# EasyEDA Pro project EasyEDAPro-Schematic.epro, board MAIN
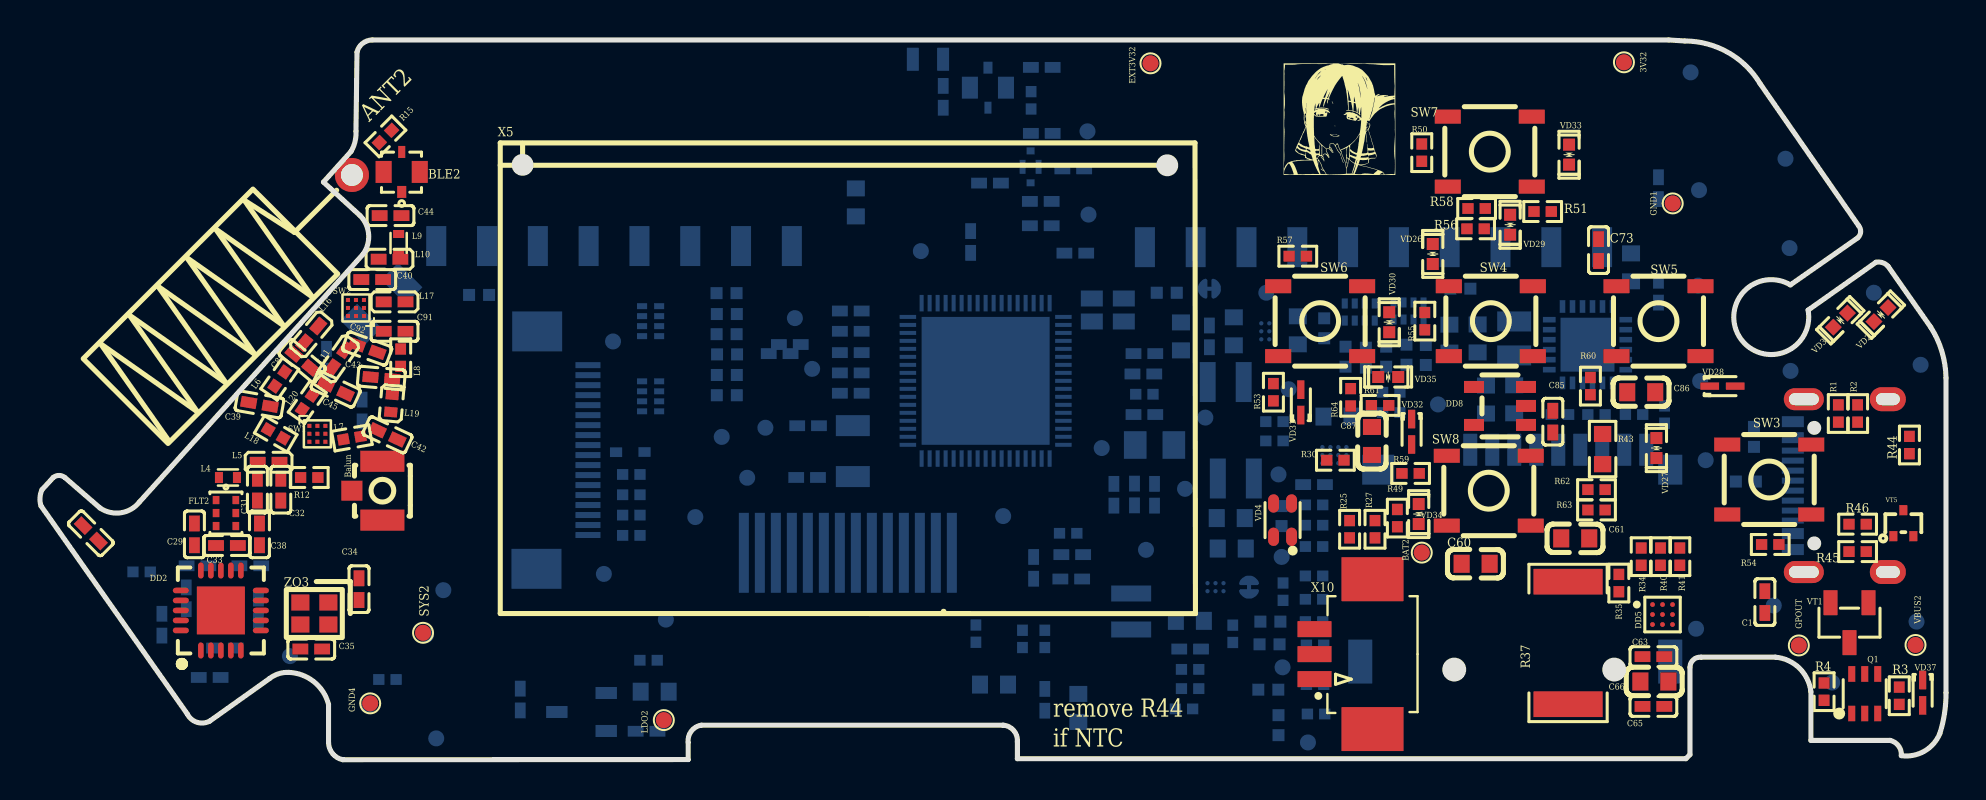
[diagram p10: board, top side]
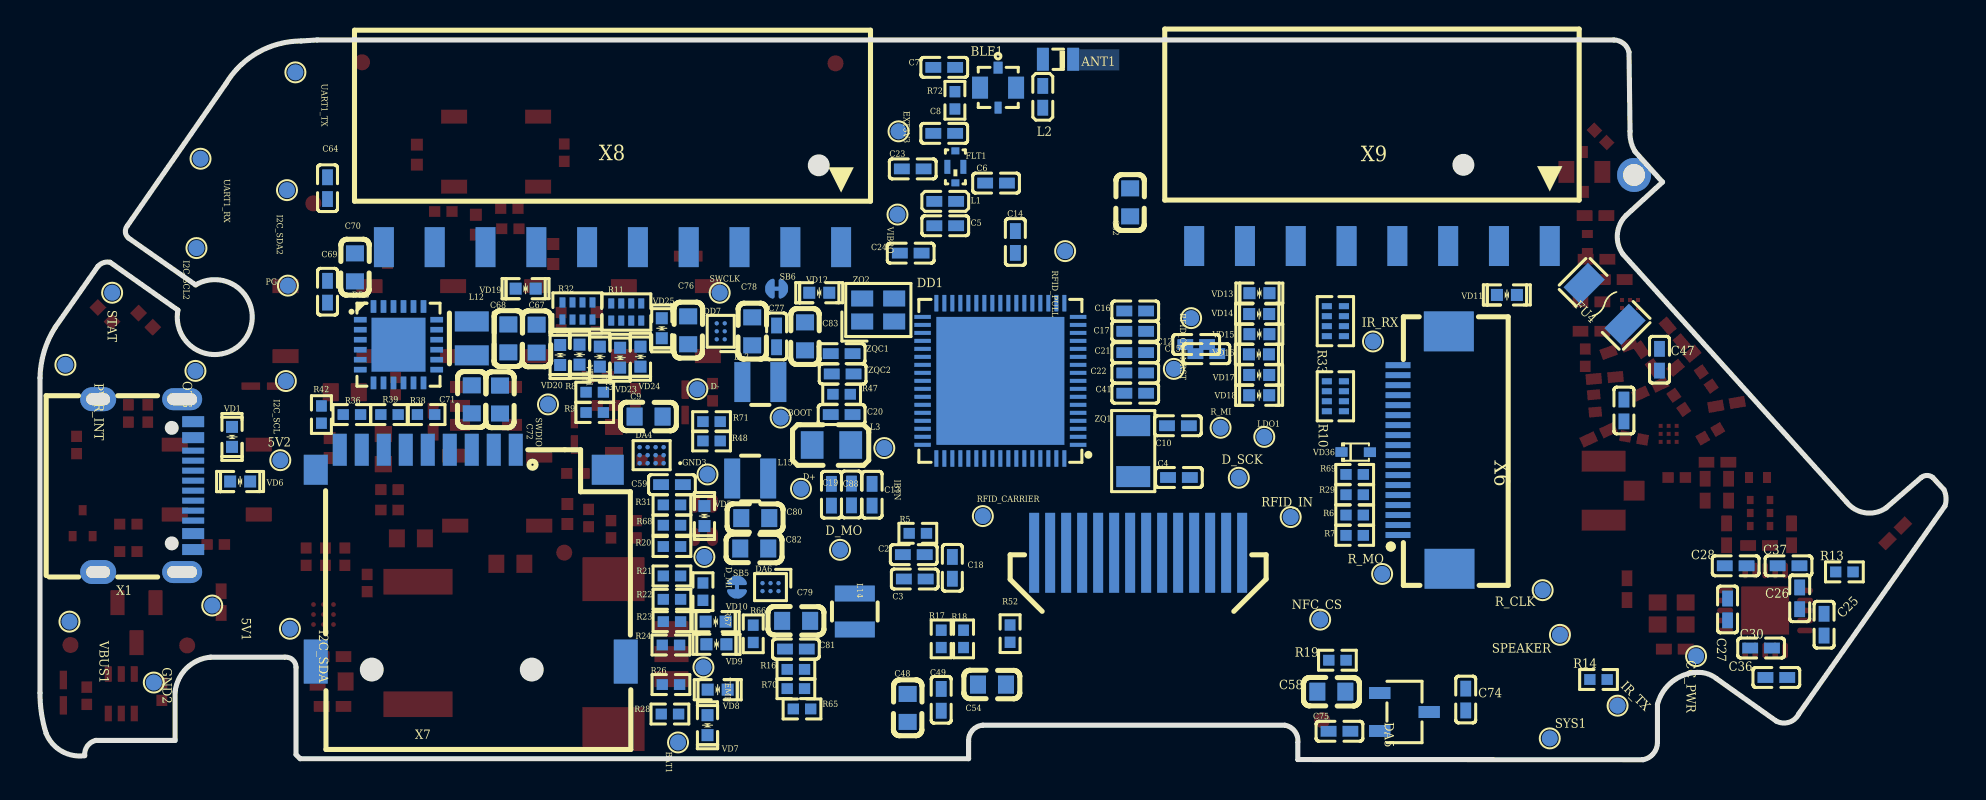
[diagram p11: board, bottom side, seen from below]

Outline 95.3 x 36.02 mm; copper layers: Top Layer, Bottom Layer. Coordinates in mm from the lower left corner of the outline.
Outline path: 0.05,12.7 arc(0,13.11) 0.1,13.51 0.66,14.12 arc(0.95,14.22) 1.24,14.12 3,12.6 arc(4.05,12.36) 4.98,12.9 16.15,25.3 arc(16.43,26.29) 16,27.23 14.17,28.91 15.54,30.43 arc(15.75,30.92) 15.8,31.45 15.85,35.41 arc(16.13,35.84) 16.61,36.02 81.43,36.02 82.25,35.97 arc(84.4,35.39) 86,33.83 90.93,26.72 arc(91.03,26.41) 90.88,26.11 87.52,23.76 arc(85.03,21.07) 88.4,22.5 91.8,24.89 arc(92.13,24.87) 92.41,24.69 94.54,21.64 arc(95.1,20.42) 95.3,19.1 95.3,3.35 arc(95.23,2.33) 95,1.32 arc(94.22,0.43) 93.07,0.2 arc(92.93,0.69) 92.51,0.97 88.55,0.97 88.55,3.4 arc(87.96,4.59) 86.77,5.13 83.06,5.13 arc(82.67,5) 82.5,4.62 82.5,0.25 82.3,0.05 48.87,0.05 48.87,0.91 arc(48.68,1.47) 48.16,1.73 33.07,1.73 arc(32.56,1.43) 32.41,0.86 32.41,0.01 15.14,0 arc(14.63,0.31) 14.43,0.86 14.43,2.77 arc(13.7,3.9) 12.45,4.37 arc(11.94,4.3) 11.48,4.06 8.48,1.93 arc(7.85,1.87) 7.37,2.29 0.05,12.7
Stack: Top Layer 0.035mm / Dielectric1 1.51mm FR4 er 4.5 / Bottom Layer 0.035mm

## Design rules (mm)
template: JLCPCB Capability(Two Layers Board)
spacing copperThickness1oz (default): track to track 0.102, other pairs 0.152 to 0.3
spacing copperThickness2oz: track to track 0.203, other pairs 0.152 to 0.3
track width copperThickness1oz (default): min 0.127, default 0.254, max 2.54
track width copperThickness2oz: min 0.203, default 0.254, max 2.54
differential pair differentialPair (default): width min 0.127, default 0.254, max 2.54; gap min 0.152, default 0.152
via viaSize (default): diameter min 0.5, default 0.61, max 10; hole min 0.3, default 0.305, max 6.3

## Placement (name value [footprint] x y rotation side)
3V32  -  [测试点0.8mm]  79.2 34.9 0 top
5V1  -  [测试点0.8mm]  86.69 7.72 180 bottom
5V2  -  [测试点0.8mm]  83.29 14.99 270 bottom
?  100pF  [C0402]  2.54 11.33 135 top
ANT1  KH-1608-H08  [ANT-SMD_L1.7-W0.9]  44.4 35.05 180 bottom
ANT2  VG868SNX18-5W2  [ANT-TH_VG868SNX18-5W2]  15.6 29.26 225 top
Balun  BWIPX-1-001E  [IPEX-SMD_BWIPX-1-001E]  16.36 13.46 0 top
BAT1  -  [测试点0.8mm]  63.4 0.86 180 bottom
BAT2  -  [测试点0.8mm]  69.09 10.36 0 top
BLE1  MM8030-2610RK0  [RF-SMD_MM8030-2610RK0]  47.4 33.63 0 bottom
BLE2  MM8030-2610RK0  [RF-SMD_MM8030-2610RK0]  18.08 29.41 0 top
BOOT  -  [测试点0.8mm]  58.27 17.12 270 bottom
C1  100nF  [C0402]  86.24 7.89 270 top
C2  100nF  [C0402]  51.61 10.26 180 bottom
C3  100nF  [C0402]  51.56 9.04 180 bottom
C4  12pF  [C0402]  38.35 14.12 0 bottom
C5  0.8pF  [C0402]  50.04 26.72 180 bottom
C6  0.3pF  [C0402]  47.5 28.85 180 bottom
C7  1.5pF  [C0402]  50.09 34.65 0 bottom
C8  1.5pF  [C0402]  50.09 31.34 0 bottom
C9  10uF  [C0603]  64.87 17.17 180 bottom
C10  12pF  [C0402]  38.4 16.71 0 bottom
C12  100nF  [C0402]  37.49 20.78 180 bottom
C13  100nF  [C0402]  53.7 13.26 270 bottom
C14  100nF  [C0402]  46.53 25.91 90 bottom
C15  4.7uF  [C0402]  36.98 20.32 180 bottom
C16  1uF  [C0402]  40.54 22.45 180 bottom
C17  10nF  [C0402]  40.54 21.44 180 bottom
C18  100nF  [C0402]  49.68 9.6 270 bottom
C19  4.7uF  [C0402]  55.73 13.26 270 bottom
C20  4.7uF  [C0402]  55.22 17.27 0 bottom
C21  1uF  [C0402]  40.54 20.37 180 bottom
C22  100nF  [C0402]  40.54 19.36 180 bottom
C23  100pF  [C0402]  51.66 29.57 180 bottom
C24  100nF  [C0402]  51.77 25.35 180 bottom
C25  100nF  [C0402]  6.1 6.76 90 bottom
C26  100nF  [C0402]  7.32 8.08 270 bottom
C27  100nF  [C0402]  10.92 7.52 270 bottom
C28  100nF  [C0402]  10.52 9.7 180 bottom
C29  100pF  [C0402]  7.72 11.28 270 top
C30  100nF  [C0402]  9.25 5.59 0 bottom
C31  1.5pF  [C0402]  10.87 13.51 270 top
C32  1.2pF  [C0402]  12.04 13.51 90 top
C33  0.6pF  [C0402]  9.35 10.72 180 top
C34  9pF  [C0402]  15.95 8.53 270 top
C35  9pF  [C0402]  13.56 5.54 180 top
C36  100nF  [C0402]  8.48 4.11 0 bottom
C37  100nF  [C0402]  7.87 9.7 0 bottom
C38  100pF  [C0402]  10.97 11.28 270 top
C39  1.5pF  [C0402]  10.97 17.78 350 top
C40  1.5pF  [C0402]  16.61 24.03 0 top
C41  100nF  [C0402]  40.54 18.34 0 bottom
C42  10pF  [C0402]  17.37 16.26 155 top
C43  10pF  [C0402]  17.07 19.1 355 top
C44  1.5pF  [C0402]  17.53 27.23 180 top
C45  8.2pF  [C0402]  14.78 18.54 155 top
C46  10nF  [C0402]  16.1 17.48 270 bottom
C47  10nF  [C0402]  14.33 20.02 270 bottom
C48  10uF  [C0603]  51.92 2.59 270 bottom
C49  100nF  [C0402]  50.24 3 270 bottom
C54  2.2uF  [C0603]  47.7 3.76 180 bottom
C58  2.2uF  [C0603]  30.73 3.4 0 bottom
C59  1uF  [C0402]  63.7 13.77 180 bottom
C60  10uF  [C0603]  71.78 9.8 0 top
C61  10uF  [C0603]  76.76 11.07 0 top
C62  10uF  [C0603]  40.79 27.89 90 bottom
C63  1uF  [C0402]  80.67 5.16 180 top
C64  47nF  [C0402]  80.92 28.6 270 bottom
C65  470nF  [C0402]  80.67 2.67 0 top
C66  2.2uF  [C0603]  80.72 3.91 0 top
C67  10uF  [C0603]  70.47 21.07 90 bottom
C68  10uF  [C0603]  71.88 21.08 90 bottom
C69  1uF  [C0402]  80.92 23.42 90 bottom
C70  10uF  [C0603]  79.55 24.64 270 bottom
C71  10uF  [C0603]  73.71 18.03 90 bottom
C72  10uF  [C0603]  72.3 18.02 90 bottom
C73  4.7uF  [C0402]  77.93 25.5 270 top
C74  1uF  [C0402]  24.01 3.01 270 bottom
C75  1uF  [C0402]  30.33 1.42 180 bottom
C76  2.2uF  [C0603]  62.89 21.49 270 bottom
C77  4.7uF  [C0402]  58.47 21.18 90 bottom
C78  2.2uF  [C0603]  59.69 21.44 270 bottom
C79  2.2uF  [C0603]  57.49 6.95 180 bottom
C80  10uF  [C0603]  59.54 12.09 180 bottom
C81  4.7uF  [C0402]  57.51 5.54 180 bottom
C82  2.2uF  [C0603]  59.59 10.57 180 bottom
C83  10uF  [C0603]  57.05 21.18 90 bottom
C85  100nF  [C0402]  75.64 16.92 90 top
C86  10uF  [C0603]  80.06 18.39 0 top
C87  10uF  [C0603]  66.6 15.95 90 top
C88  100nF  [C0402]  54.73 13.27 270 bottom
C89  1.5pF  [C0402]  13.11 19.96 140 top
C91  22pF  [C0402]  17.73 21.44 0 top
C92  1.5pF  [C0402]  16.36 20.57 340 top
CC_PWR  -  [测试点0.8mm]  12.5 5.18 180 bottom
D+  -  [测试点0.8mm]  57.25 13.56 180 bottom
D-  -  [测试点0.8mm]  62.43 18.54 180 bottom
D_MI  -  [测试点0.8mm]  62.08 10.15 180 bottom
D_MO  -  [测试点0.8mm]  55.3 10.5 180 bottom
D_SCK  -  [测试点0.8mm]  35.36 14.11 180 bottom
DA4  LP5562TMX/NOPB  [DSBGA-12_L1.7-W1.3-R3-C4-P0.40-TL]  64.72 15.24 0 bottom
DA5  RS3221-3.3YF3  [SOT-23-3_L2.9-W1.6-P1.90-LS2.8-BR]  27.08 2.39 0 bottom
DA6  LM3281YFQR  [DSBGA-6_L1.4-W1.1-R3-C2-P0.40-BL]  58.78 8.64 0 bottom
DD1  -  [QFN-68_L8.0-W8.0-P0.40-TL-EP6.4]  47.28 18.96 0 bottom
DD2  300 ~ 348 MHz, 387 ~ 464 MHz, 779 ~ 928 MHz  [QFN-20_L4.0-W4.0-P0.5-TL-EP]  9.04 7.47 90 top
DD5  BQ27220YZFR  [DSBGA-9_L1.7-W1.6-R3-C3-P0.50-BL]  81.13 7.26 270 top
DD6  BQ25896RTWR  [QFN-24_L4.0-W4.0-P0.50-TL-EP2.7]  77.38 20.77 180 bottom
DD7  LM3281YFQR  [DSBGA-6_L1.4-W1.1-R3-C2-P0.40-BL]  61.26 21.44 90 bottom
DD8  SN74LVC1G32DBVR  [SOT-23-5_L3.0-W1.7-P0.95-LS2.8-BR]  73 17.7 0 top
EXT3V3  -  [测试点0.8mm]  52.37 31.45 180 bottom
EXT3V32  -  [测试点0.8mm]  55.52 34.85 0 top
FLT1  LFB182G45SG9A272  [FILTER-SMD_0603-4P-L1.6-W0.8-T]  49.53 29.67 90 bottom
FLT2  B0310J50100AHF  [XFMR-SMD_6P-L2.1-W1.3-P0.65-BL]  9.3 12.34 270 top
FU4  0466004.NRHF  [F1206]  17.07 22.81 225 bottom
GND1  -  [测试点0.8mm]  81.64 27.84 0 top
GND2  -  [测试点0.8mm]  89.61 3.86 180 bottom
GND3  -  [测试点0.8mm]  61.93 14.27 180 bottom
GND4  -  [测试点0.8mm]  16.51 2.82 0 top
GPOUT  -  [测试点0.8mm]  87.94 5.72 0 top
I2C_SCL  -  [测试点0.8mm]  83.01 18.95 180 bottom
I2C_SCL2  -  [测试点0.8mm]  87.48 25.6 90 bottom
I2C_SDA  -  [测试点0.8mm]  82.8 6.55 180 bottom
I2C_SDA2  -  [测试点0.8mm]  82.95 28.5 90 bottom
IBTN  -  [测试点0.8mm]  53.09 15.6 180 bottom
IR_RX  -  [测试点0.8mm]  28.65 20.93 180 bottom
IR_TX  -  [测试点0.8mm]  16.42 2.7 180 bottom
L1  2.7nH  [L0402]  50.04 27.94 180 bottom
L2  0.3nH  [L0402]  45.16 33.17 90 bottom
L3  10uH  [L0805]  55.73 15.75 180 bottom
L4  3.3nH  [IND-SMD_L1.0-W0.5-2]  9.4 14.12 0 top
L5  6.8nH  [L0402]  11.43 14.88 0 top
L6  0Ω  [R0402]  11.99 19.05 55 top
L7  0Ω  [R0402]  15.6 16.1 10 top
L8  0Ω  [R0402]  18.03 20.12 90 top
L9  2.2nH  [IND-SMD_L1.0-W0.5-2]  17.93 25.86 90 top
L10  DNF  [L0402]  17.48 25.04 0 top
L11  2.7nH  [L0402]  14.94 20.07 55 top
L12  1uH  [IND-SMD_L2.0-W1.6-B]  73.71 21.08 270 bottom
L13  470nH  [IND-SMD_L2.0-W1.6_MHCHL201610A-1R0M-Q8A]  59.28 18.9 180 bottom
L14  470nH  [IND-SMD_L2.0-W1.6_MHCHL201610A-1R0M-Q8A]  54.56 7.42 270 bottom
L15  470nH  [IND-SMD_L2.0-W1.6_MHCHL201610A-1R0M-Q8A]  59.79 14.07 0 bottom
L16  56nH  [L0402]  13.56 21.29 50 top
L17  22nH  [L0402]  17.73 22.91 180 top
L18  0Ω  [R0402]  11.79 16.31 150 top
L19  27nH  [IND-SMD_L1.0-W0.6]  17.58 17.83 85 top
L20  0Ω  [R0402]  13.36 17.88 55 top
LDO1  -  [测试点0.8mm]  34.09 16.15 180 bottom
LDO2  -  [测试点0.8mm]  31.19 1.98 0 top
NFC_CS  -  [测试点0.8mm]  31.29 7.01 180 bottom
NRST  -  [测试点0.8mm]  38.61 19.56 180 bottom
OTG  -  [测试点0.8mm]  87.53 19.46 180 bottom
PG  -  [测试点0.8mm]  82.91 23.72 180 bottom
PWR_INT  -  [测试点0.8mm]  94.03 19.76 180 bottom
Q1  MMDT2907A-7-F  [SOT-363_L2.0-W1.3-P0.65-LS2.1-BL]  91.24 3.3 0 top
R1  5.1kΩ  [R0402]  89.92 17.32 270 top
R2  5.1kΩ  [R0402]  90.88 17.32 270 top
R3  100kΩ  [R0402]  92.96 3.2 270 top
R4  100kΩ  [R0402]  89.2 3.4 90 top
R5  10kΩ  [R0402]  51.41 11.33 0 bottom
R6  51Ω  [R0402]  29.57 12.24 180 bottom
R7  51Ω  [R0402]  29.57 11.23 0 bottom
R8  22Ω  [R0402]  67.56 18.39 180 bottom
R9  22Ω  [R0402]  67.56 17.37 180 bottom
R10  51Ω  [RES-ARRAY-SMD_0402-8P-L2.0-W1.0-BL]  30.53 18.19 270 bottom
R11  51Ω  [RES-ARRAY-SMD_0402-8P-L2.0-W1.0-BL]  65.99 22.4 180 bottom
R12  0Ω  [R0402]  13.46 14.12 0 top
R13  56kΩ  [R0402]  5.08 9.4 180 bottom
R14  330Ω  [R0402]  17.37 4.01 0 bottom
R15  0Ω  [R0402]  17.27 31.19 225 top
R16  1.5Ω  [R0402]  57.51 4.52 0 bottom
R17  10kΩ  [R0402]  50.24 6.05 90 bottom
R18  10kΩ  [R0402]  49.12 6.05 90 bottom
R19  0Ω  [R0402]  30.43 4.98 180 bottom
R20  0Ω  [R0402]  63.7 10.67 0 bottom
R21  47kΩ  [R0402]  63.7 9.19 0 bottom
R22  47kΩ  [R0402]  63.7 8.03 0 bottom
R23  150Ω  [R0402]  63.7 6.91 180 bottom
R24  51Ω  [R0402]  63.75 5.74 180 bottom
R25  0Ω  [R0402]  65.48 11.53 90 top
R26  51Ω  [R0402]  63.75 3.76 180 bottom
R27  0Ω  [R0402]  66.75 11.53 90 top
R28  51Ω  [R0402]  63.8 2.29 180 bottom
R29  51Ω  [R0402]  29.57 13.26 0 bottom
R30  0Ω  [R0402]  64.77 14.99 0 top
R31  150Ω  [R0402]  63.7 12.75 180 bottom
R32  51Ω  [RES-ARRAY-SMD_0402-8P-L2.0-W1.0-BL]  68.43 22.45 180 bottom
R33  51Ω  [RES-ARRAY-SMD_0402-8P-L2.0-W1.0-BL]  30.53 21.95 270 bottom
R34  10kΩ  [R0402]  80.06 10.16 270 top
R35  10kΩ  [R0402]  78.94 8.84 90 top
R36  470Ω  [R0402]  79.71 17.27 180 bottom
R37  10mΩ  [R2512]  76.4 5.84 270 top
R38  5.23kΩ  [R0402]  76 17.27 0 bottom
R39  30.1kΩ  [R0402]  77.83 17.27 180 bottom
R40  1.5kΩ  [R0402]  81.03 10.16 90 top
R41  1.5kΩ  [R0402]  81.99 10.16 90 top
R42  1.5kΩ  [R0402]  81.23 17.27 270 bottom
R43  NCP18XH103F03RB  [R0603]  78.13 15.55 270 top
R44  10kΩ  [R0402]  93.47 15.75 90 top
R45  100Ω  [R0402]  90.88 10.41 0 top
R46  10kΩ  [R0402]  90.88 11.79 0 top
R47  10kΩ  [R0402]  55.22 18.29 0 bottom
R48  3.3Ω  [R0402]  61.72 15.95 0 bottom
R49  10kΩ  [R0402]  67.87 12.09 90 top
R50  10kΩ  [R0402]  69.09 30.38 270 top
R51  10kΩ  [R0402]  75.13 27.43 0 top
R52  10kΩ  [R0402]  46.8 6.31 270 bottom
R53  10kΩ  [R0402]  61.67 18.39 90 top
R54  330Ω  [R0402]  86.51 10.77 0 top
R55  330Ω  [R0402]  69.24 21.95 90 top
R56  330Ω  [R0402]  71.78 26.57 0 top
R57  330Ω  [R0402]  62.89 25.2 0 top
R58  330Ω  [R0402]  71.83 27.58 0 top
R59  330Ω  [R0402]  68.53 14.33 0 top
R60  100kΩ  [R0402]  77.52 18.69 270 top
R61  10kΩ  [R0402]  67.01 17.73 0 top
R62  10kΩ  [R0402]  77.83 13.51 0 top
R63  510Ω  [R0402]  77.83 12.5 0 top
R64  100kΩ  [R0402]  65.53 18.14 270 top
R65  10kΩ  [R0402]  57.2 2.54 0 bottom
R66  10kΩ  [R0402]  59.64 6.3 270 bottom
R67  10kΩ  [R0402]  62.15 8.41 90 bottom
R68  47kΩ  [R0402]  63.7 11.73 180 bottom
R69  1kΩ  [R0402]  29.57 14.27 180 bottom
R70  1.5Ω  [R0402]  57.51 3.56 0 bottom
R71  3.3Ω  [R0402]  61.72 16.92 0 bottom
R72  0Ω  [R0402]  49.55 33 90 bottom
R_CLK  -  [测试点0.8mm]  20.17 8.48 180 bottom
R_MI  -  [测试点0.8mm]  36.27 16.61 180 bottom
R_MO  -  [测试点0.8mm]  28.19 9.3 180 bottom
RFID_CARRIER  -  [测试点0.8mm]  48.16 12.19 180 bottom
RFID_IN  -  [测试点0.8mm]  32.77 12.14 180 bottom
RFID_OUT  -  [测试点0.8mm]  37.74 22.1 180 bottom
RFID_PULL  -  [测试点0.8mm]  44.04 25.45 180 bottom
SB5  net tie  [Solderbridge_Shorted]  60.45 8.64 90 bottom
SB6  net tie  [Solderbridge_Shorted]  58.47 23.57 180 bottom
SPEAKER  -  [测试点0.8mm]  19.3 6.25 180 bottom
STAT  -  [测试点0.8mm]  91.69 23.37 180 bottom
SW1  BGS 13S4N9 E6327  [TSNP-9_L1.1-W1.1-P0.40-BL]  13.87 16.31 270 top
SW2  BGS 13S4N9 E6327  [TSNP-9_L1.1-W1.1-P0.40-BL]  15.8 22.61 90 top
SW3  TS45055A  [SW-SMD_4P-L4.5-W4.5-P3.50-LS5.0]  86.46 14.02 0 top
SW4  TS45055A  [SW-SMD_4P-L4.5-W4.5-P3.50-LS5.0]  72.54 21.95 180 top
SW5  TS45055A  [SW-SMD_4P-L4.5-W4.5-P3.50-LS5.0]  80.92 21.95 0 top
SW6  TS45055A  [SW-SMD_4P-L4.5-W4.5-P3.50-LS5.0]  64.01 21.95 0 top
SW7  TS45055A  [SW-SMD_4P-L4.5-W4.5-P3.50-LS5.0]  72.49 30.43 0 top
SW8  TS45055A  [SW-SMD_4P-L4.5-W4.5-P3.50-LS5.0]  72.44 13.46 0 top
SWCLK  -  [测试点0.8mm]  61.32 23.37 180 bottom
SWDIO  -  [测试点0.8mm]  69.9 17.78 180 bottom
SYS1  -  [测试点0.8mm]  19.81 1.07 180 bottom
SYS2  -  [测试点0.8mm]  19.15 6.35 0 top
TEMP  -  [测试点0.8mm]  62.13 4.62 180 bottom
UART1_RX  -  [测试点0.8mm]  87.27 30.07 180 bottom
UART1_TX  -  [测试点0.8mm]  82.53 34.4 180 bottom
VBUS1  -  [测试点0.8mm]  93.83 6.91 180 bottom
VBUS2  -  [测试点0.8mm]  93.78 5.74 0 top
VD1  AU0561M1S  [D0402-BI]  85.7 16.15 90 bottom
VD2  AU0561M1S  [D0402-BI]  92.05 22.28 45 top
VD3  AU0561M1S  [D0402-BI]  90.02 22 45 top
VD4  LTST-C19HE1WT  [LED-ARRAY-SMD_4P-L1.6-W1.6-TL-CW]  62.13 11.99 180 top
VD5  AU0561M1S  [D0402-BI]  62.08 12.19 270 bottom
VD6  AU0561M1S  [D0402-BI]  85.29 13.92 180 bottom
VD7  AU0561M1S  [D0402-BI]  61.93 1.73 90 bottom
VD8  AU0561M1S  [D0402-BI]  61.42 3.51 0 bottom
VD9  AU0561M1S  [D0402-BI]  61.48 5.78 0 bottom
VD10  AU0561M1S  [D0402-BI]  61.52 6.91 0 bottom
VD11  AU0561M1S  [D0402-BI]  21.95 23.26 180 bottom
VD12  AU0561M1S  [D0402-BI]  56.34 23.37 180 bottom
VD13  AU0561M1S  [D0402-BI]  34.33 23.35 180 bottom
VD14  AU0561M1S  [D0402-BI]  34.34 22.3 180 bottom
VD15  AU0561M1S  [D0402-BI]  34.33 21.29 180 bottom
VD16  AU0561M1S  [D0402-BI]  34.35 20.28 180 bottom
VD17  AU0561M1S  [D0402-BI]  34.34 19.25 180 bottom
VD18  AU0561M1S  [D0402-BI]  34.34 18.24 180 bottom
VD19  AU0561M1S  [D0402-BI]  71.02 23.57 180 bottom
VD20  AU0561M1S  [D0402-BI]  69.29 20.25 90 bottom
VD21  AU0561M1S  [D0402-BI]  68.33 20.27 90 bottom
VD22  AU0561M1S  [D0402-BI]  67.31 20.17 90 bottom
VD23  AU0561M1S  [D0402-BI]  66.29 20.12 90 bottom
VD24  AU0561M1S  [D0402-BI]  65.28 20.17 90 bottom
VD25  AU0561M1S  [D0402-BI]  64.21 21.59 90 bottom
VD26  AU0561M1S  [D0402-BI]  69.64 25.31 270 top
VD27  AU0561M1S  [D0402-BI]  80.82 15.6 90 top
VD28  1N4148WT  [SOD-523_L1.2-W0.8-LS1.6-RD]  84.12 18.69 0 top
VD29  AU0561M1S  [D0402-BI]  73.51 26.77 90 top
VD30  AU0561M1S  [D0402-BI]  67.46 21.89 90 top
VD31  1N4148WT  [SOD-523_L1.2-W0.8-LS1.6-RD]  63.04 17.88 90 top
VD32  1N4148WT  [SOD-523_L1.2-W0.8-LS1.6-RD]  68.58 16.41 270 top
VD33  AU0561M1S  [D0402-BI]  76.45 30.28 90 top
VD34  AU0561M1S  [D0402-BI]  68.94 12.29 90 top
VD35  AU0561M1S  [D0402-BI]  67.41 19.15 0 top
VD36  1N4148X-TP  [SOD-523F_L1.2-W0.8-LS1.7-RD]  29.51 15.39 180 bottom
VD37  DNF  [SOD-523_L1.2-W0.8-LS1.6-RD]  94.13 3.35 270 top
VIBRO  -  [测试点0.8mm]  52.43 27.28 180 bottom
VT1  DMP1045U-7  [SOT-23-3_L2.9-W1.3-P1.90-LS2.4-BR]  90.47 6.86 90 top
VT5  DMN313DLT-7  [SOT-523-3_L1.6-W0.8-P1.00-LS1.6-BR]  93.17 11.84 270 top
X1  TYPE-C 16PIN 2MD(073)  [USB-C-SMD_TYPE-C-6PIN-2MD-073]  90.02 13.72 270 bottom
X5  -  [COG12864-12]  40.39 7.57 0 top
X6  FPC-05F-18PH20  [FPC-SMD_18P-P0.50_FPC-05F-18PH20]  26.11 15.49 90 bottom
X7  TF PUSH  [TF-SMD_TF-PUSH]  73.76 10.21 180 bottom
X8  -  [HDR-SMD_10P-P2.54-H-F-L11.5]  66.04 25.76 0 bottom
X9  X6511FRS-08-C85D30  [HDR-SMD_8P-P2.54-H-F-L11.5]  28.7 25.7 0 bottom
X10  1.25T-3P卧贴  [CONN-SMD_3P-P1.25_1.25T-3PWT]  65.18 5.28 270 top
ZQ1  32.768kHz  [OSC-SMD_L3.2-W1.5]  40.64 15.44 270 bottom
ZQ2  32MHz  [CRYSTAL-SMD_4P-L2.0-W1.6-BL-2]  53.39 22.5 180 bottom
ZQ3  26MHz  [CRYSTAL-SMD_4P-L2.0-W1.6-BL_HUAXIN_CN4]  13.72 7.32 180 top
ZQC1  18pF  [C0402]  55.22 20.32 180 bottom
ZQC2  18pF  [C0402]  55.17 19.3 180 bottom

## Footprints (pads in the part's own frame, mm; a bottom-side part is the same pattern mirrored in y, then rotated)
ANT-SMD_L1.7-W0.9
  rect 0.6x1.15 smd: 1(-0.756,0) 2(0.756,0)
ANT-TH_VG868SNX18-5W2
  round 1.7 hole 1.1: 1(0,0)
C0402
  rect 0.79x0.54 smd: 1(-0.545,0) 2(0.545,0)
C0603
  rect 0.8x0.9 smd: 1(-0.7,0) 2(0.7,0)
COG12864-12
  rect 0.5x4 smd far side: 1(5.207,2.785) 2(4.407,2.785) 3(3.607,2.785) 4(2.807,2.785) 5(2.007,2.785) 6(1.207,2.785) 7(0.407,2.785) 8(-0.393,2.785) 9(-1.193,2.785) 10(-1.993,2.785) 11(-2.793,2.785) 12(-3.593,2.785) 13(-4.393,2.785) 14(-5.193,2.785)
CONN-SMD_3P-P1.25_1.25T-3PWT
  rect 0.8x1.7 smd: 1(1.25,-1.45) 2(0,-1.45) 3(-1.25,-1.45)
  rect 2.2x3.1 smd: 4(-3.75,1.45) 5(3.75,1.45)
CRYSTAL-SMD_4P-L2.0-W1.6-BL-2
  rect 1.1x0.8 smd: 1(-0.8,-0.575) 2(0.8,-0.575) 3(0.8,0.575) 4(-0.8,0.575)
CRYSTAL-SMD_4P-L2.0-W1.6-BL_HUAXIN_CN4
  rect 0.9x0.8 smd: 1(-0.7,-0.55) 2(0.7,-0.55) 3(0.7,0.55) 4(-0.7,0.55)
D0402-BI
  rect 0.6x0.6 smd: 1(-0.5,0) 2(0.5,0)
DSBGA-6_L1.4-W1.1-R3-C2-P0.40-BL
  round 0.216 smd: A1(-0.4,-0.2) A2(-0.4,0.2) B1(0,-0.2) B2(0,0.2) C1(0.4,-0.2) C2(0.4,0.2)
DSBGA-9_L1.7-W1.6-R3-C3-P0.50-BL
  round 0.24 smd: A1(-0.5,-0.5) A2(-0.5,0) A3(-0.5,0.5) B1(0,-0.5) B2(0,0) B3(0,0.5) C1(0.5,-0.5) C2(0.5,0) C3(0.5,0.5)
DSBGA-12_L1.7-W1.3-R3-C4-P0.40-TL
  round 0.225 smd: A1(-0.6,0.4) A2(-0.2,0.4) A3(0.2,0.4) A4(0.6,0.4) B1(-0.6,0) B2(-0.2,0) B3(0.2,0) B4(0.6,0) C1(-0.6,-0.4) C2(-0.2,-0.4) C3(0.2,-0.4) C4(0.6,-0.4)
F1206
  rect 1.19x1.728 smd: 1(-1.445,0) 2(1.445,0)
FILTER-SMD_0603-4P-L1.6-W0.8-T
  rect 0.7x0.3 smd: 1(0,0.4) 3(0,-0.4)
  rect 0.35x0.4 smd: 2(0.8,0) 4(-0.8,0)
FPC-SMD_18P-P0.50_FPC-05F-18PH20
  rect 0.3x1.25 smd: 1(-4.25,1.288) 2(-3.75,1.288) 3(-3.25,1.288) 4(-2.75,1.288) 5(-2.25,1.288) 6(-1.75,1.288) 7(-1.25,1.288) 8(-0.75,1.288) 9(-0.25,1.288) 10(0.25,1.288) 11(0.75,1.288) 12(1.25,1.288) 13(1.75,1.288) 14(2.25,1.288) 15(2.75,1.288) 16(3.25,1.288) 17(3.75,1.288) 18(4.25,1.288)
  rect 2x2.5 smd: 19(-5.94,-1.288) 20(5.94,-1.252)
HDR-SMD_8P-P2.54-H-F-L11.5
  rect 1x2 smd: 1(-8.89,0) 2(-6.35,0) 3(-3.81,0) 4(-1.27,0) 5(1.27,0) 6(3.81,0) 7(6.35,0) 8(8.89,0)
HDR-SMD_10P-P2.54-H-F-L11.5
  rect 1x2 smd: 1(-10.795,0.107) 2(-8.255,0.107) 3(-5.715,0.107) 4(-3.175,0.107) 5(-0.635,0.107) 6(1.905,0.107) 7(4.445,0.107) 8(6.985,0.107) 9(9.525,0.107) 10(12.065,0.107)
IND-SMD_L1.0-W0.5-2
  rect 0.4x0.55 smd: 1(-0.45,0) 2(0.45,0)
IND-SMD_L1.0-W0.6
  rect 0.5x0.648 smd: 1(-0.434,0) 2(0.434,0)
IND-SMD_L2.0-W1.6-B
  rect 1x1.7 smd: 1(-0.85,0) 2(0.85,0)
IND-SMD_L2.0-W1.6_MHCHL201610A-1R0M-Q8A
  rect 0.8x2 smd: 1(-0.9,0) 2(0.9,0)
IPEX-SMD_BWIPX-1-001E
  rect 1.05x1 smd: 1(-0.762,0)
  rect 2.2x1.05 smd: 2(0.762,-1.475) 3(0.762,1.475)
L0402
  rect 0.79x0.54 smd: 1(-0.545,0) 2(0.545,0)
L0805
  rect 1.133x1.377 smd: 1(-0.966,0) 2(0.966,0)
LED-ARRAY-SMD_4P-L1.6-W1.6-TL-CW
  oval 0.55x0.917 smd: 1(-0.45,0.834) 2(0.45,0.834) 3(0.45,-0.834) 4(-0.45,-0.834)
OSC-SMD_L3.2-W1.5
  rect 1.05x1.7 smd: 1(-1.275,0) 2(1.275,0)
QFN-20_L4.0-W4.0-P0.5-TL-EP
  oval 0.8x0.28 smd: 1(-2,1) 2(-2,0.5) 3(-2,0) 4(-2,-0.5) 5(-2,-1) 11(2,-1) 12(2,-0.5) 13(2,0) 14(2,0.5) 15(2,1)
  oval 0.28x0.8 smd: 6(-1,-2) 7(-0.5,-2) 8(0,-2) 9(0.5,-2) 10(1,-2) 16(1,2) 17(0.5,2) 18(0,2) 19(-0.5,2) 20(-1,2)
  rect 2.4x2.4 smd: 21(0,0)
QFN-24_L4.0-W4.0-P0.50-TL-EP2.7
  rect 0.633x0.28 smd: 1(-1.911,1.25) 2(-1.911,0.75) 3(-1.911,0.25) 4(-1.911,-0.25) 5(-1.911,-0.75) 6(-1.911,-1.25) 13(1.911,-1.25) 14(1.911,-0.75) 15(1.911,-0.25) 16(1.911,0.25) 17(1.911,0.75) 18(1.911,1.25)
  rect 0.28x0.633 smd: 7(-1.25,-1.911) 8(-0.75,-1.911) 9(-0.25,-1.911) 10(0.25,-1.911) 11(0.75,-1.911) 12(1.25,-1.911) 19(1.25,1.911) 20(0.75,1.911) 21(0.25,1.911) 22(-0.25,1.911) 23(-0.75,1.911) 24(-1.25,1.911)
  rect 2.7x2.7 smd: 25(0,0)
QFN-68_L8.0-W8.0-P0.40-TL-EP6.4
  rect 0.825x0.2 smd: 1(-3.888,3.2) 2(-3.888,2.8) 3(-3.888,2.4) 4(-3.888,2) 5(-3.888,1.6) 6(-3.888,1.2) 7(-3.888,0.8) 8(-3.888,0.4) 9(-3.888,0) 10(-3.888,-0.4) 11(-3.888,-0.8) 12(-3.888,-1.2) 13(-3.888,-1.6) 14(-3.888,-2) 15(-3.888,-2.4) 16(-3.888,-2.8) 17(-3.888,-3.2) 35(3.888,-3.2) 36(3.888,-2.8) 37(3.888,-2.4) 38(3.888,-2) 39(3.888,-1.6) 40(3.888,-1.2) 41(3.888,-0.8) 42(3.888,-0.4) 43(3.888,0) 44(3.888,0.4) 45(3.888,0.8) 46(3.888,1.2) 47(3.888,1.6) 48(3.888,2) 49(3.888,2.4) 50(3.888,2.8) 51(3.888,3.2)
  rect 0.2x0.825 smd: 18(-3.2,-3.888) 19(-2.8,-3.888) 20(-2.4,-3.888) 21(-2,-3.888) 22(-1.6,-3.888) 23(-1.2,-3.888) 24(-0.8,-3.888) 25(-0.4,-3.888) 26(0,-3.888) 27(0.4,-3.888) 28(0.8,-3.888) 29(1.2,-3.888) 30(1.6,-3.888) 31(2,-3.888) 32(2.4,-3.888) 33(2.8,-3.888) 34(3.2,-3.888) 52(3.2,3.888) 53(2.8,3.888) 54(2.4,3.888) 55(2,3.888) 56(1.6,3.888) 57(1.2,3.888) 58(0.8,3.888) 59(0.4,3.888) 60(0,3.888) 61(-0.4,3.888) 62(-0.8,3.888) 63(-1.2,3.888) 64(-1.6,3.888) 65(-2,3.888) 66(-2.4,3.888) 67(-2.8,3.888) 68(-3.2,3.888)
  rect 6.4x6.4 smd: 69(0,0)
R0402
  rect 0.566x0.54 smd: 1(-0.433,0) 2(0.433,0)
R0603
  rect 0.806x0.864 smd: 1(-0.753,0) 2(0.753,0)
R2512
  rect 1.282x3.456 smd: 1(-3.067,0) 2(3.067,0)
RES-ARRAY-SMD_0402-8P-L2.0-W1.0-BL
  rect 0.3x0.505 smd: 1(-0.75,0.427) 2(-0.25,0.427) 3(0.25,0.427) 4(0.75,0.427) 5(0.75,-0.427) 6(0.25,-0.427) 7(-0.25,-0.427) 8(-0.75,-0.427)
RF-SMD_MM8030-2610RK0
  rect 0.45x0.6 smd: 1(0,-1)
  rect 0.35x0.6 smd: 2(0,1)
  rect 0.8x1.1 smd: 3(-0.901,0) 3(0.901,0)
SOD-523_L1.2-W0.8-LS1.6-RD
  rect 0.93x0.36 smd: 1(-0.635,0) 2(0.635,0)
SOD-523F_L1.2-W0.8-LS1.7-RD
  custom 0.609x0.483 smd: 1(-0.711,0.005) 2(0.711,-0.005)
Solderbridge_Shorted
  round 0.2 smd: 1(-0.338,0) 2(0.338,0)
SOT-23-3_L2.9-W1.3-P1.90-LS2.4-BR
  rect 1.25x0.7 smd: 1(1,-0.95) 2(1,0.95) 3(-1,0)
SOT-23-3_L2.9-W1.6-P1.90-LS2.8-BR
  rect 1.07x0.6 smd: 1(1.235,-0.95) 2(1.235,0.95) 3(-1.235,0)
SOT-23-5_L3.0-W1.7-P0.95-LS2.8-BR
  rect 1x0.6 smd: 1(1.3,-0.95) 2(1.3,0) 3(1.3,0.95) 4(-1.3,0.95) 5(-1.3,-0.95)
SOT-363_L2.0-W1.3-P0.65-LS2.1-BL
  rect 0.35x0.78 smd: 1(-0.65,-0.99) 2(0,-0.99) 3(0.65,-0.99) 4(0.65,0.99) 5(0,0.99) 6(-0.65,0.99)
SOT-523-3_L1.6-W0.8-P1.00-LS1.6-BR
  rect 0.51x0.4 smd: 1(0.65,-0.5) 2(0.65,0.5) 3(-0.65,0)
SW-SMD_4P-L4.5-W4.5-P3.50-LS5.0
  rect 1.3x0.7 smd: 1(-2.1,1.75) 2(2.1,1.75) 3(-2.1,-1.75) 4(2.1,-1.75)
TF-SMD_TF-PUSH
  rect 0.7x1.6 smd: 1(2.25,5.3) 2(1.15,5.3) 3(0.05,5.3) 4(-1.05,5.3) 5(-2.15,5.3) 6(-3.25,5.3) 7(-4.35,5.3) 8(-5.45,5.3) CD(-6.55,5.3)
  rect 1.2x1.5 smd: 10(-7.75,4.3)
  rect 1.2x2.2 smd: 11(-7.75,-5.3) 12(7.75,-5.3)
  rect 1.6x1.5 smd: 13(6.85,4.3)
TSNP-9_L1.1-W1.1-P0.40-BL
  rect 0.2x0.2 smd: 1(-0.4,-0.4) 2(0,-0.4) 3(0.4,-0.4) 4(0.4,0) 5(0.4,0.4) 6(0,0.4) 7(-0.4,0.4) 8(-0.4,0) 9(0,0)
USB-C-SMD_TYPE-C-6PIN-2MD-073
  rect 0.55x1.1 smd: 1(-3.2,2.375) 2(-2.4,2.375) 11(2.4,2.375) 12(3.2,2.375)
  rect 0.3x1.1 smd: 3(-1.75,2.375) 4(-1.25,2.375) 5(-0.75,2.375) 6(-0.25,2.375) 7(0.25,2.375) 8(0.75,2.375) 9(1.25,2.375) 10(1.75,2.375)
  oval 1.2x1.8 hole 0.6x1.2: 13(-4.325,-2.375) 14(4.325,-2.375)
  oval 1.1x2 hole 0.6x1.5: 13(-4.325,1.825) 14(4.325,1.825)
XFMR-SMD_6P-L2.1-W1.3-P0.65-BL
  rect 0.41x0.33 smd: 1(-0.65,-0.495) 2(0,-0.495) 3(0.65,-0.495) 4(0.65,0.495) 5(0,0.495) 6(-0.65,0.495)
测试点0.8mm
  round 0.8 smd: 1(0,0)

## Nets
As in the schematic, except:
GND: ?.1 ?.2 Balun.2 Balun.3 BLE1.3 BLE2.3 C1.2 C2.1 C3.1 C4.1 C5.2 C6.2 C7.2 C8.2 C9.1 C10.1 C12.2 C13.2 C14.2 C15.2 C16.2 C17.2 C18.2 C19.2 C20.2 C21.2 C22.2 C23.2 C24.2 C25.1 C26.1 C27.1 C28.1 C30.1 C31.2 C32.1 C34.1 C35.1 C36.1 C37.1 C39.1 C40.1 C41.1 C42.1 C43.1 C44.2 C45.1 C46.1 C47.2 C48.2 C49.2 C58.1 C59.1 C60.2 C61.2 C63.1 C65.1 C66.1 C67.1 C68.1 C69.1 C70.1 C71.1 C72.1 C73.1 C74.1 C75.1 C77.1 C80.1 C81.1 C83.1 C85.1 C86.1 C87.1 C88.2 C89.1 C91.1 C92.2 DA4.A3 DA4.B1 DA4.B2 DA4.B3 DA5.1 DD1.32 DD1.42 DD1.69 DD2.16 DD2.19 DD2.21 DD5.B2 DD6.2 DD6.9 DD6.17 DD6.18 DD6.25 DD8.3 FLT1.1 FLT1.3 FLT2.2 GND1.1 GND2.1 GND3.1 GND4.1 L10.1 R1.1 R2.1 R3.1 R4.1 R13.2 R35.2 R36.1 R39.2 R43.1 R46.1 R61.1 SB5.1 SB6.1 SW1.6 SW1.9 SW2.6 SW2.9 SW3.3 SW5.3 SW6.3 SW7.3 SW8.3 VD1.2 VD2.2 VD3.2 VD5.1 VD6.1 VD7.1 VD8.1 VD9.1 VD10.1 VD12.1 VD13.1 VD14.1 VD15.1 VD16.1 VD17.1 VD18.1 VD19.1 VD20.1 VD21.1 VD22.1 VD23.1 VD24.1 VD25.1 VD26.2 VD27.1 VD29.1 VD30.1 VD33.1 VD34.1 VD35.1 VT5.2 X5.7 X6.6 X6.8 X7.6 X7.10 X7.11 X7.12 X7.13 X8.3 X8.10 X9.8 X10.3 ZQ2.2 ZQ2.4 ZQ3.2 ZQ3.4 ZQC1.1 ZQC2.1

Pads without a net: ANT1 2; DD1 36 37; DD6 24; FLT2 5 6; R10 3 4 5 6; R11 4 5; SW3 2 4; SW4 1 3; SW5 2 4; SW6 2 4; SW7 2 4; SW8 2 4; X1 3 9; X5 10 11

## Copper pours and planes (outline as drawn; the poured copper is in the pictures)
(no net) on Bottom Layer: 41.33,35.56 43.43,35.56 43.43,34.49 41.33,34.49

## Text on the board
Top Silkscreen Layer: remove R44 / if NTC
